# EAGLE design maus-blenano2-mk-1.1.0 (EAGLE 7.5.0)
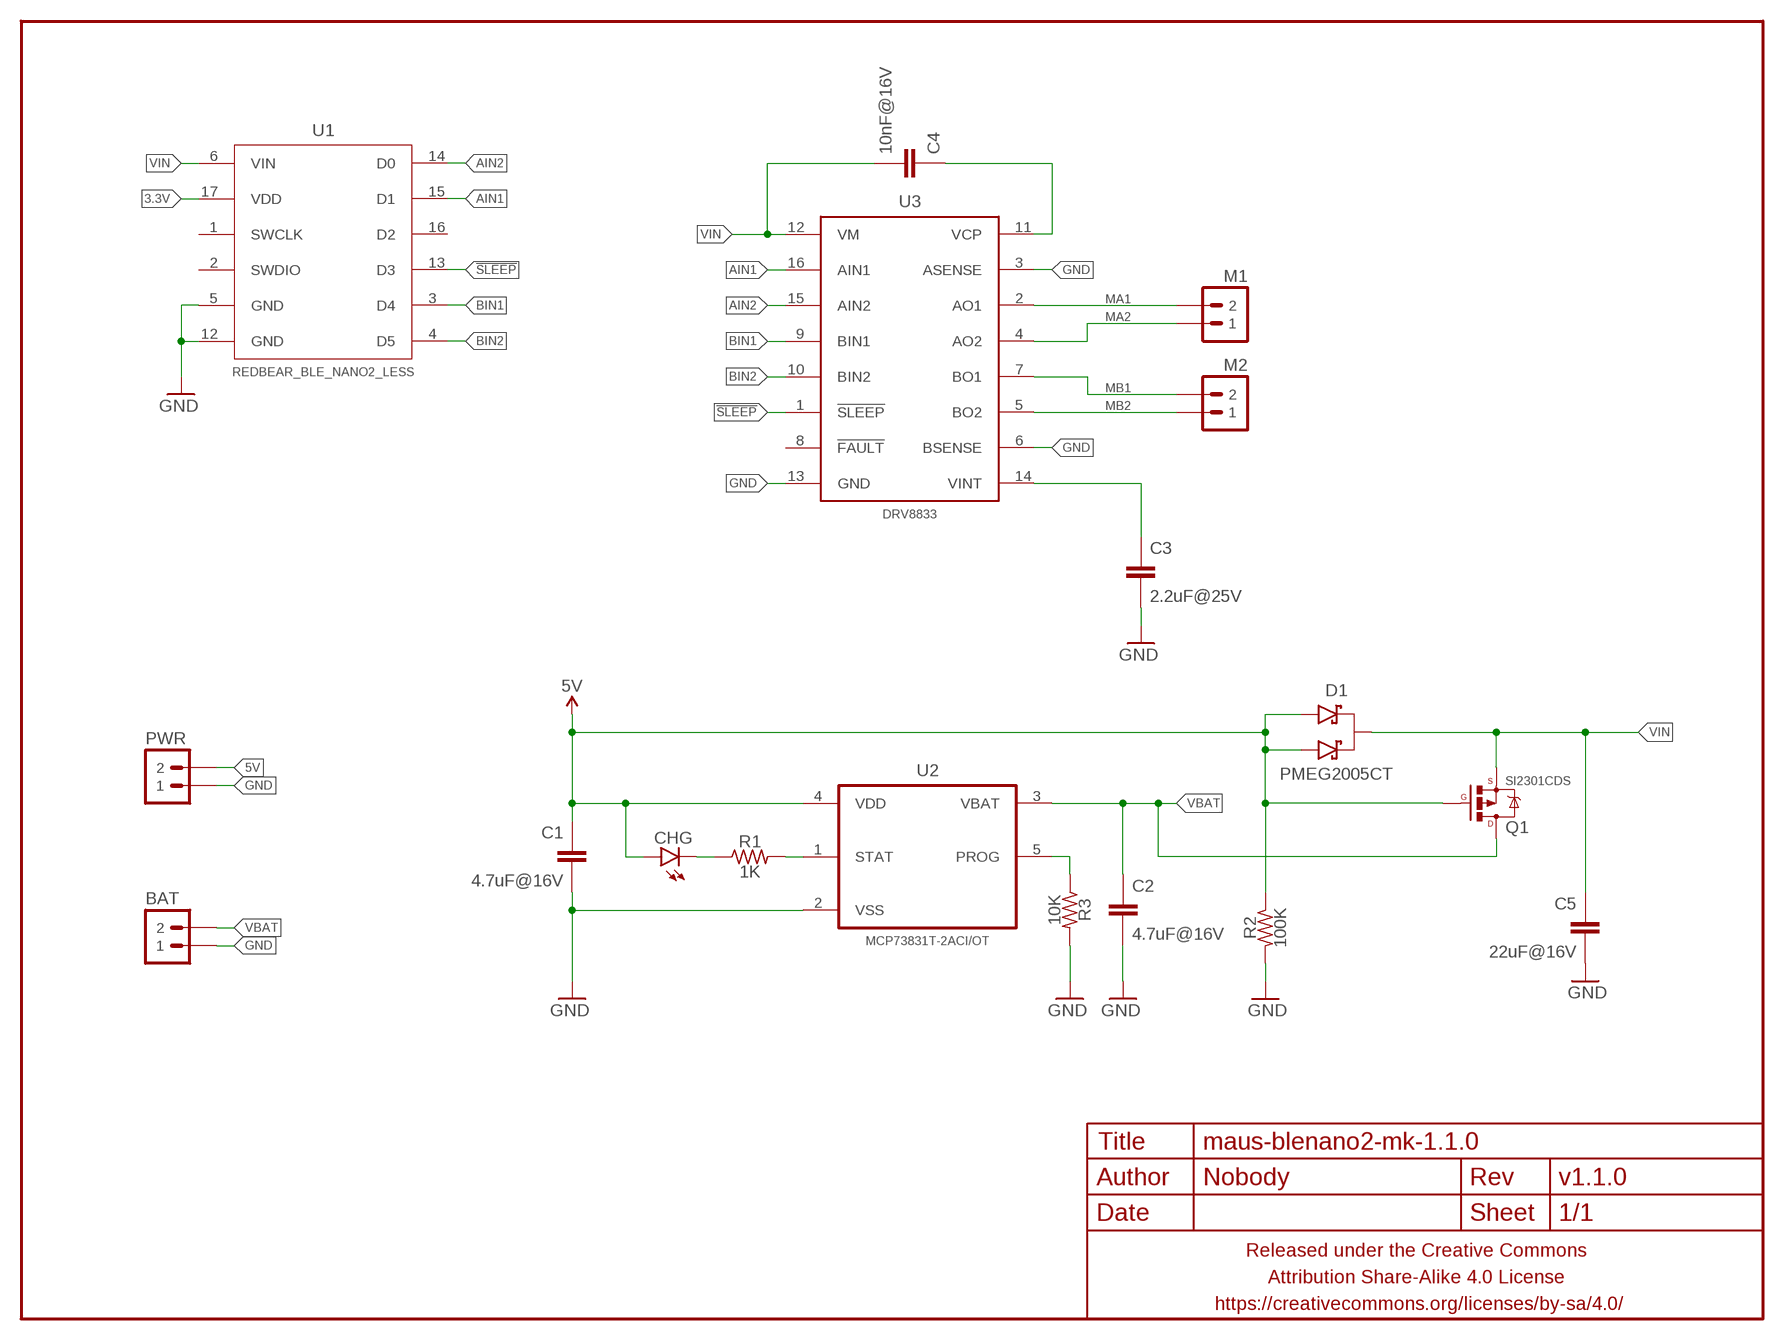
[diagram p0: schematic, sheet 1]

## Parts
BAT  M02PTH-2MM  [1X02-2MM-PTH]
C1  4.7uF@16V  CAPACITOR-CERAMICC0603-TIGHTER  [C0603-TIGHTER]
C2  4.7uF@16V  CAPACITOR-CERAMICC0603-TIGHTER  [C0603-TIGHTER]
C3  2.2uF@25V  CAPACITOR-CERAMICC0603  [C0603]
C4  10nF@16V  CAPACITOR-CERAMICC0402  [C0402]
C5  22uF@16V  CAPACITOR-CERAMICC1206  [C1206]
CHG  LED0603-TIGHT  [LED-0603-TIGHT]
D1  PMEG2005CT  DIODE-SCHOTTKY-DUALPMEG2005CT  [SOT23]
FRAME1  FRAME-LETTERNO_PACKAGE  [DUMMY]
M1  M02PTH-2MM  [1X02-2MM-PTH]
M2  M02PTH-2MM  [1X02-2MM-PTH]
PWR  M02PTH-2MM  [1X02-2MM-PTH]
Q1  SI2301CDS  MOSFET-PCHANNELSOT-23  [SOT23]
R1  1K  RESISTORR0603-TIGHTER  [R0603-TIGHTER]
R2  100K  RESISTORR0603-TIGHTER  [R0603-TIGHTER]
R3  10K  RESISTORR0603-TIGHTER  [R0603-TIGHTER]
U1  REDBEAR_BLE_NANO2_LESS  [REDBEAR_BLE_NANO2_LESS]
U2  MCP73831T-2ACI/OT  [SOT95P280X145-5N]
U3  DRV8833  DRV8833PW  [TSSOP16]

## Nets
3.3V: U1.17(VDD)
5V: C1.1 CHG.A D1.1(A1) D1.2(A2) PWR.P$2 Q1.1(G) R2.1 U2.4(VDD)
!SLEEP: U1.13(D3) U3.1(!SLEEP)
AIN1: U1.15(D1) U3.16(AIN1)
AIN2: U1.14(D0) U3.15(AIN2)
BIN1: U1.3(D4) U3.9(BIN1)
BIN2: U1.4(D5) U3.10(BIN2)
GND: BAT.P$1 C1.2 C2.2 C3.2 C5.2 PWR.P$1 R2.2 R3.2 U1.5(GND) U1.12(GND) U2.2(VSS) U3.3(ASENSE) U3.6(BSENSE) U3.13(GND)
MA1: M1.P$2 U3.2(AO1)
MA2: M1.P$1 U3.4(AO2)
MB1: M2.P$2 U3.7(BO1)
MB2: M2.P$1 U3.5(BO2)
N$1: R1.2 U2.1(STAT)
N$2: CHG.C R1.1
N$3: C3.1 U3.14(VINT)
N$4: C4.1 U3.11(VCP)
N$11: R3.1 U2.5(PROG)
VBAT: BAT.P$2 C2.1 Q1.3(D) U2.3(VBAT)
VIN: C4.2 C5.1 D1.3(K) Q1.2(S) U1.6(VIN) U3.12(VM)
Unconnected: U1.1(SWCLK) U1.2(SWDIO) U1.16(D2) U3.8(!FAULT)

## Library data of the parts
BAT M1 M2 PWR = a_parts:M02: Standard 2-pin 0.1" header. Use with - straight break away headers ( PRT-00116) - right angle break away headers (PRT-00553) - swiss pins (PRT-00743) - machine pins (PRT-00117) - female headers (PRT-00115) Molex polarized connector foot print use with: PRT-08233 with associated crimp pins and housings. 2.54_SCREWTERM for use with PRT-10571. 3.5mm Screw Terminal footprints for PRT-08084 5mm Screw Terminal footprints for use with PRT-08433
C1-C5 = a_parts:CAPACITOR-CERAMIC: CAPACITOR, European symbol
CHG = a_parts:LED: LEDs Standard schematic elements and footprints for 5mm, 3mm, 1206, and 0603 sized LEDs. 5mm - Spark Fun Electronics SKU : COM-00529 (and others)
D1 = a_parts:DIODE-SCHOTTKY-DUAL
FRAME1 = a_parts:FRAME-LETTER: Schematic Frame Standard 8.5x11 US Letter frame; DESIGNER: Nobody; VERSION: v1.1.0
Q1 = a_parts:MOSFET-PCHANNEL: Generic PMOSFET IRLML2244 - TRANS-11153 (SOT-23 -20V -4.3A) (1.Gate 2.Source 3.Drain) FQP27P06 - COM-10349 <http://www.sparkfun.com/products/10349> (TO-220 -60V -27A) (1.Gate 2.Source 3.Drain)
R1-R3 = a_parts:RESISTOR: RESISTOR, American symbol
U1 = a_parts:REDBEAR_BLE_NANO2_LESS
U2 = a_parts:MCP73831T-2ACI/OT: Charge Management Controller; MPN: MCP73831T-2ACI/OT; OC_FARNELL: 1332158; OC_NEWARK: 56K7045; PACKAGE: SOT-5; SUPPLIER: Microchip
U3 = a_parts:DRV8833

## Board
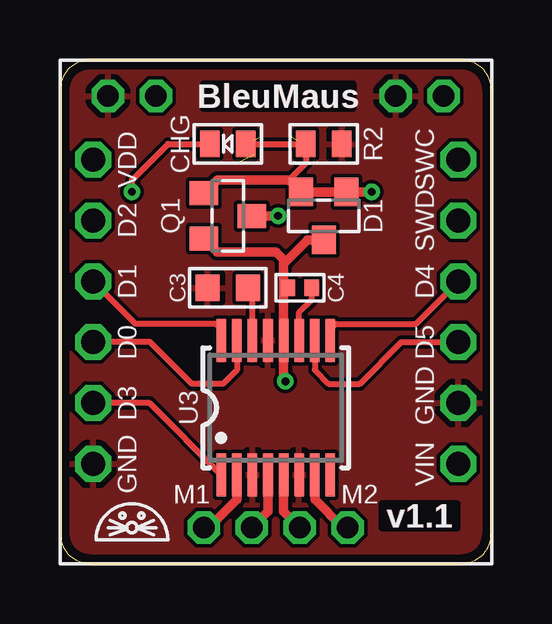
[diagram p1: board, top side]
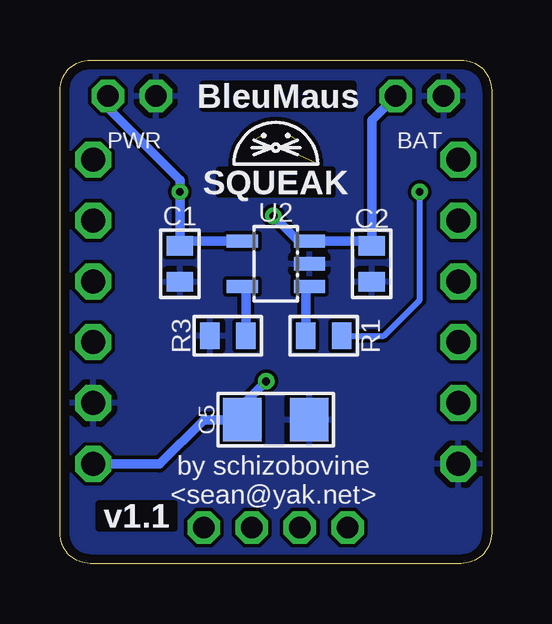
[diagram p2: board, bottom side, seen from below]

Size 18 x 21 mm. Coordinates in mm from the lower left corner, seen from the top.
Outline: 1.27,0 16.73,0 arc90 18,1.27 18,19.73 arc90 16.73,21 1.27,21 arc90 0,19.73 0,1.27 arc90 1.27,0
Copper layers (1*16): Top 0.0356mm / dielectric 1.5011mm / Bottom 0.0356mm
Design rules "LaenPCBOrder2": minimum track width 6mil, minimum drill 13mil, track to track 6mil, track to pad 6mil, pad to pad 6mil, via to via 6mil, smd to smd 6mil, copper to edge 15mil, drill to drill 6mil, minimum pad ring 7mil, minimum via ring 7mil, stop-mask expansion 3mil, vias tented up to drill 20mil, thermal gap 10mil

### Footprints (pad centres in the part's own frame; a part is rotated, then mirrored left to right if it is on the bottom)
1X02-2MM-PTH = drill 0.9 octagon: P$1 -1,0; P$2 1,0
C0603-TIGHTER = smd 0.8 x 1.1: 1 -0.75,0; 2 0.75,0
C0603 = smd 1 x 1.1: 1 -0.85,0; 2 0.85,0
C0402 = smd 0.6 x 0.7: 1 -0.5,0; 2 0.5,0
C1206 = smd 1.6 x 1.8: 1 -1.4,0; 2 1.4,0
LED-0603-TIGHT = smd 0.8 x 1.1: A 0.75,0; C -0.75,0
SOT23 = smd 1 x 1.2: 1 -0.95,-1; 2 0.95,-1; 3 0,1
R0603-TIGHTER = smd 0.8 x 1.1: 1 -0.75,0; 2 0.75,0
REDBEAR_BLE_NANO2_LESS = drill 1 octagon: 1 7.62,6.35; 2 7.62,3.81; 3 7.62,1.27; 4 7.62,-1.27; 5 7.62,-3.81; 6 7.62,-6.35; 12 -7.62,-6.35; 13 -7.62,-3.81; 14 -7.62,-1.27; 15 -7.62,1.27; 16 -7.62,3.81; 17 -7.62,6.35
SOT95P280X145-5N = smd 1.3 x 0.55: 1 -1.4,0.95; 2 -1.4,0; 3 -1.4,-0.95; 4 1.4,-0.95; 5 1.4,0.95
TSSOP16 = smd 0.4 x 1.8: 1 -2.275,-2.8; 2 -1.625,-2.8; 3 -0.975,-2.8; 4 -0.325,-2.8; 5 0.325,-2.8; 6 0.975,-2.8; 7 1.625,-2.8; 8 2.275,-2.8; 9 2.275,2.8; 10 1.625,2.8; 11 0.975,2.8; 12 0.325,2.8; 13 -0.325,2.8; 14 -0.975,2.8; 15 -1.625,2.8; 16 -2.275,2.8

### Placement (x,y rotation side)
BAT  3,19.5 180 bottom
C1  13,12.5 270 bottom
C2  5,12.5 270 bottom
C3  7,11.5 180 top
C4  10,11.5 180 top
C5  9,6 0 bottom
CHG  7,17.5 0 top
D1  11,14.5 180 top
FRAME1  0,0 0 top
M1  7,1.5 180 top
M2  11,1.5 0 top
PWR  15,19.5 180 bottom
Q1  7,14.5 270 top
R1  7,9.5 180 bottom
R2  11,17.5 0 top
R3  11,9.5 180 bottom
U1  9,10.5 0 top
U2  9,12.5 180 bottom
U3  9,6.5 0 top

### Tracks (layer width: path | path; a pad name or v marks a point on that pad's centre or on a via)
5V  (via drill 0.33)
  Top 0.254: CHG.A R2.1 10.25,16.7 9.55,16
  Top 0.4: v13,15.5 D1.1 D1.2 9.55,16 6.55,16 Q1.1
  Bottom 0.4: U2.4 12.8,13.45 C1.1 v13,15.5 13,16 16,19 PWR.P$2
!SLEEP
  Top 0.254: U3.1 3.73,6.69 U1.13
AIN1
  Top 0.254: U3.16 6.72,9.78 6.5,10 3.15,10 U1.15
AIN2
  Top 0.254: U3.15 7.38,8.07 6.8,7.5 5.5,7.5 3.77,9.23 U1.14
BIN1
  Top 0.254: U3.9 11.28,9.78 11.5,10 14.85,10 U1.3
BIN2
  Top 0.254: U3.10 10.62,8.07 11.2,7.5 12.5,7.5 14.23,9.23 U1.4
FOO  (3 unrouted)
  Bottom 0.152: 8,17.35 8.85,17.35 | 8.1,17.65 8.85,17.35 | 8.1,17.05 8.85,17.35 | 10,17.35 9.15,17.35 | 9.9,17.05 9.15,17.35 | 9.9,17.65 9.15,17.35 | 8.85,17.35 arc-180 9.15,17.35 | 9.15,17.35 arc-180 8.85,17.35 | 7.25,16.65 arc-180 10.75,16.65 7.25,16.65 | 8.45,17.85 arc-180 8.55,17.85 arc-180 8.45,17.85 | 9.45,17.85 arc-180 9.55,17.85 arc-180 9.45,17.85
GND
  pour Bottom: 0,19.73 0,1.27 arc90 1.27,0 16.73,0 arc90 18,1.27 18,19.73 arc90 16.73,21 1.27,21 arc90
  pour Top: 18,19.73 18,1.27 arc-90 16.73,0 1.27,0 arc-90 0,1.27 0,19.73 arc-90 1.27,21 16.73,21 arc-90
MA1
  Top 0.4: U3.2 7.38,2.67 6.2,1.5 M1.P$2
MA2
  Top 0.4: U3.4 8.68,2.17 M1.P$1
MB1
  Top 0.4: U3.7 10.62,2.67 11.8,1.5 M2.P$2
MB2
  Top 0.4: U3.5 9.32,2.17 M2.P$1
N$1
  Bottom 0.4: R1.2 7.75,11.4 U2.1
N$2  (via drill 0.33)
  Top 0.254: v3,15.5 3,16 4.5,17.5 CHG.C
  Bottom 0.254: R1.1 4.5,9.5 3,11 v3,15.5
N$3
  Top 0.254: U3.14 8.03,11.32 C3.1
N$4
  Top 0.254: U3.11 9.97,10.47 10.5,11 C4.1
N$11
  Bottom 0.4: R3.1 10.25,11.4 U2.5
VBAT  (via drill 0.33)
  Top 0.4: v9.1,14.5 Q1.3
  Bottom 0.4: v9.1,14.5 8.05,13.45 U2.3 5.2,13.45 C2.1 5,18.5 BAT.P$2
VIN  (via drill 0.33)
  Top 0.4: 9.32,11.5 U3.12 9.32,7.67 v9.4,7.6 | 9.32,11.5 9.32,12.5 | 9.32,12.5 9.32,12.68 9,13 6.55,13 Q1.2 | C4.2 9.32,11.5 | 9.32,12.5 10.32,13.5 D1.3
  Bottom 0.4: v9.4,7.6 10.4,6.6 C5.1 12,6 13.85,4.15 U1.6

### Text on the board
Top: BleuMaus
Bottom: BleuMaus | SQUEAK
tPlace: BleuMaus
bPlace: BleuMaus | SQUEAK | by schizobovine / <sean@yak.net>